# EAGLE design Beacon (EAGLE 6.1)
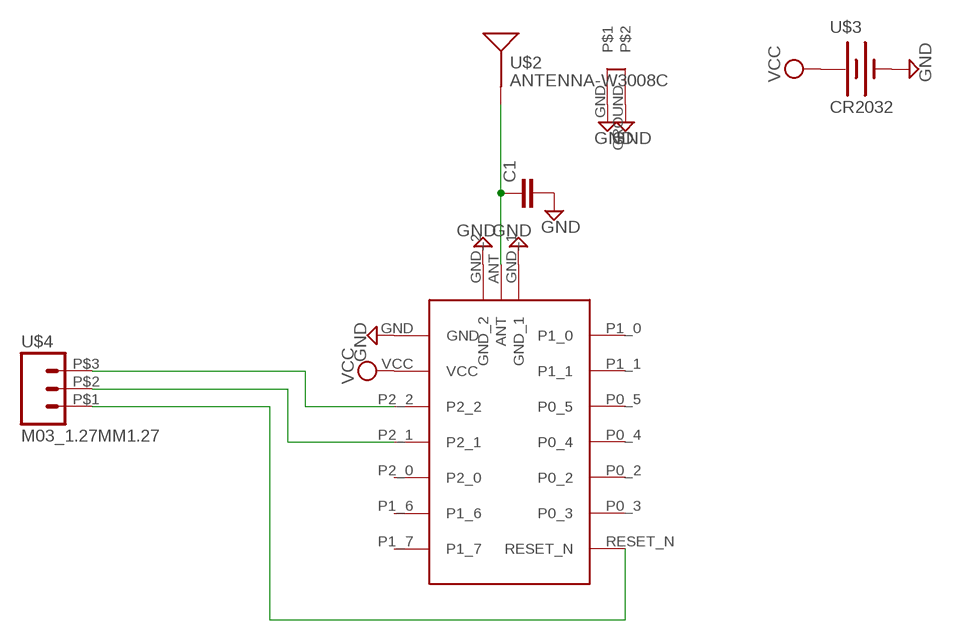
[diagram p0: schematic, sheet 1]

## Parts
C1  CAP0402-CAP  [0402-CAP]
U$1  BLE4  [BLE4]
U$2  ANTENNA-W3008C  [ANTENNA-W3008C]
U$3  CR2032  [BATTCON_2032]
U$4  M03_1.27MM1.27  [1X3_1.27MM]

## Nets
GND: C1.2 U$1.GND U$1.GND_1 U$1.GND_2 U$2.GND U$2.GROUND U$3.PWR@2(-)
N$1: C1.1 U$1.ANT U$2.FEED(SIGNAL)
N$2: U$1.P2_2 U$4.P$3
N$3: U$1.P2_1 U$4.P$2
N$4: U$1.RESET_N U$4.P$1
VCC: U$1.VCC U$3.PWR@1(+)
Unconnected: U$1.P0_2 U$1.P0_3 U$1.P0_4 U$1.P0_5 U$1.P1_0 U$1.P1_1 U$1.P1_6 U$1.P1_7 U$1.P2_0

## Library data of the parts
C1 = SparkFun-Capacitors:CAP: Capacitor Standard 0603 ceramic capacitor, and 0.1" leaded capacitor.
U$1 = foxkn:BLE4
U$2 = SparkFun-RF:ANTENNA-W3008C
U$3 = SparkFun-Electromechanical:CR2032
U$4 = SparkFun-Connectors:M03_1.27MM

## Board
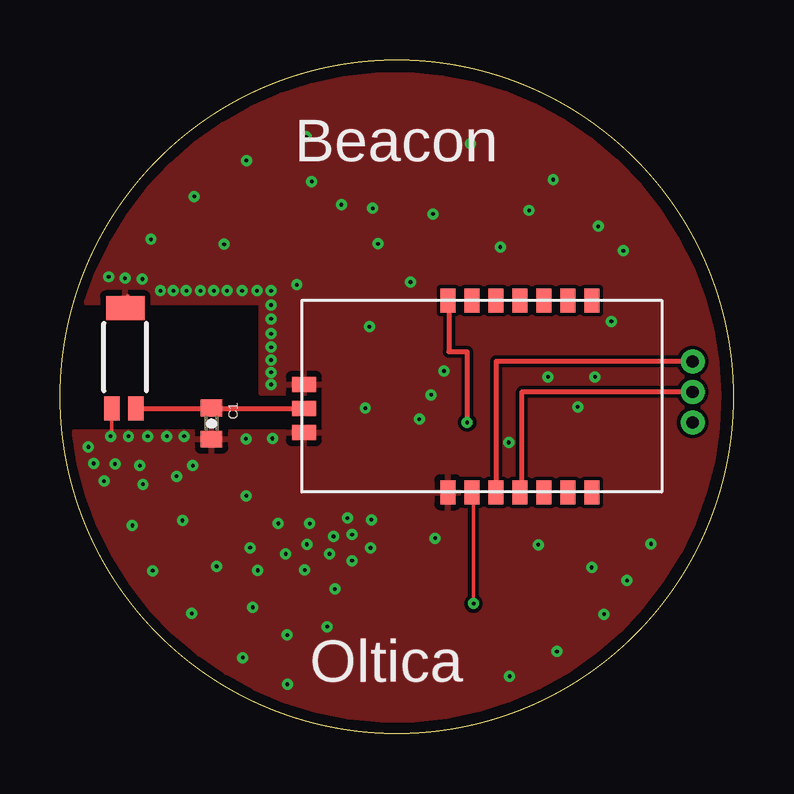
[diagram p1: board, top side]
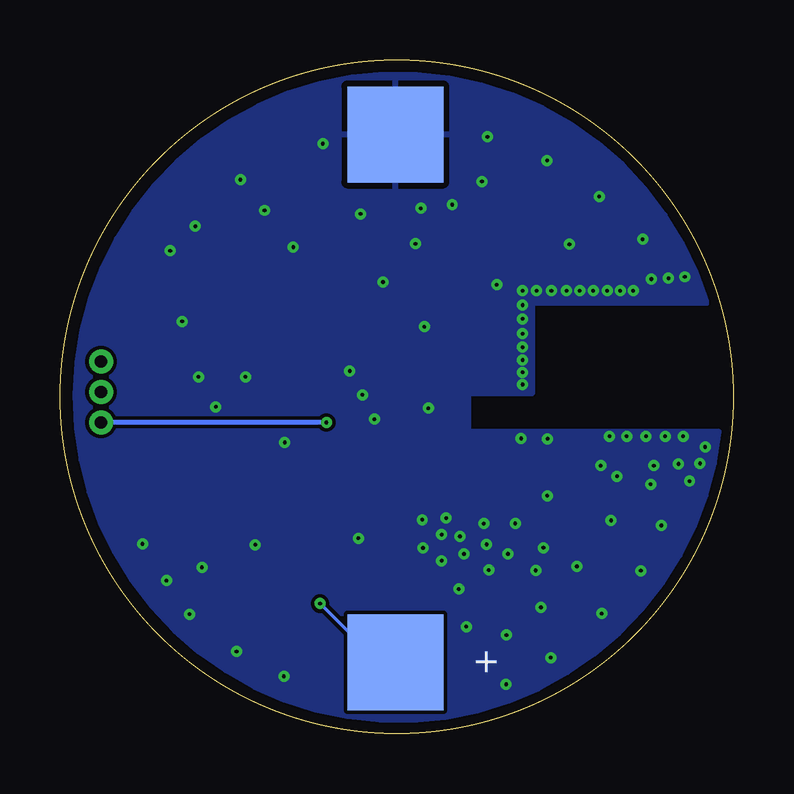
[diagram p2: board, bottom side, seen from below]

Size 28.09 x 28.09 mm. Coordinates in mm from the lower left corner, seen from the top.
Outline: circle at 14.04,14.04 radius 14.04
Copper layers (1*16): Top 0.035mm / dielectric 1.5mm / Bottom 0.035mm
Design rules: minimum track width 6mil, minimum drill 6mil, track to track 6mil, track to pad 6mil, pad to pad 6mil, via to via 6mil, smd to smd 6mil, copper to edge 8mil, drill to drill 6mil, minimum pad ring 6mil, minimum via ring 6mil, stop-mask expansion 4mil, vias tented up to drill 0mil, thermal gap 10mil

### Footprints (pad centres in the part's own frame; a part is rotated, then mirrored left to right if it is on the bottom)
0402-CAP = smd 0.7 x 0.9: 1 -0.65,0; 2 0.65,0
BLE4 = smd 1 x 0.635: ANT 8.54,0.5; GND_1 8.54,-0.5; GND_2 8.54,1.5 | smd 0.635 x 1: GND 2.54,4; P0_2 0.54,-4; P0_3 1.54,-4; P0_4 -0.46,-4; P0_5 -1.46,-4; P1_0 -3.46,-4; P1_1 -2.46,-4; P1_6 -2.46,4; P1_7 -3.46,4; P2_0 -1.46,4; P2_1 -0.46,4; P2_2 0.54,4; RESET_N 2.54,-4; VCC 1.54,4
ANTENNA-W3008C = smd 0.65 x 1: FEED -0.45,2.52; GROUND 0.55,2.52 | smd 1.6 x 1: GND 0,-1.651
BATTCON_2032 = smd 4 x 4: PWR@1 -11.46,0; PWR@2 10.54,0
1X3_1.27MM = drill 0.508 pad 1: P$1 -1.27,0; P$2 0,0; P$3 1.27,0

### Placement (x,y rotation side)
C1  6.32,12.93 270 top
U$1  18.71,14.06 180 top
U$2  2.72,16.08 180 top
U$3  14.1,14.43 90 bottom
U$4  26.38,14.24 90 top

### Tracks (layer width: path | path; a pad name or v marks a point on that pad's centre or on a via)
GND  (via drill 0.15)
  Top 0.152: U$2.GROUND 2.16,13.52 2.16,12.91 2.16,12.51 v2.1,12.39 | 2.82,18.26 2.77,18.2 2.77,17.79 U$2.GND
  other vias: 3.01,8.68 3.87,6.79 5.5,5 7.62,3.16 9.48,2.05 9.47,4.11 1.84,10.52 1.4,11.26 8.04,5.26 6.53,6.97 5.11,8.89 2.3,11.24 3.46,10.4 3.33,11.17 1.19,11.95 11.46,6.03 11.14,4.46 8.25,6.81 9.41,7.49 9.1,8.76 7.93,7.75 4.86,10.73 5.54,11.17 2.85,12.39 3.65,12.39 10.21,6.82 10.3,7.89 11.99,8.98 11.41,8.22 11.24,7.49 10.41,8.75 7.77,9.92 4.45,12.39 5.18,12.39 18.75,2.39 12.98,8.91 12.95,7.74 12.18,7.21 12.18,8.3 2.03,19.04 2.71,18.99 3.43,18.95 7.75,12.29 8.86,12.31 4.19,18.46 20.72,3.43 3.79,20.61 15.64,8.15 8.8,14.55 8.8,15.06 8.8,15.57 8.8,16.11 8.8,16.67 6.96,18.46 6.41,18.46 5.85,18.46 5.27,18.46 4.73,18.46 6.84,20.4 12.73,13.57 8.8,17.29 8.8,17.87 8.8,18.46 8.21,18.46 7.6,18.46 22.68,4.98 5.6,22.39 9.87,18.72 15.48,14.13 14.98,13.11 19.94,7.87 7.78,23.9 12.9,16.96 16.01,15.12 24.64,7.91 13.04,21.9 13.26,20.43 10.49,23.02 11.73,22.05 14.61,18.83 10.26,24.88 15.55,21.67 22.17,6.93 19.56,21.82 18.36,20.28 17.12,24.59 20.56,23.09 22.99,17.19 23.49,20.13 22.44,21.15 23.64,6.38 21.59,13.62 20.35,14.87 22.31,14.87 18.71,12.14
  pour Top: 1.1,17.94 arc-337 0.59,12.59 11.04,12.59 11.04,14.18 8.38,14.18 8.38,17.94
  pour Bottom: 1.1,17.94 arc-337 0.59,12.59 11.04,12.59 11.04,14.19 8.38,14.19 8.38,17.94
N$1
  Top 0.152: C1.1 6.43,13.52 6.43,13.56
  Top 0.203: U$2.FEED 6.43,13.56 U$1.ANT
N$2
  Top 0.203: U$1.P2_2 18.19,10.06 18.19,15.53 26.38,15.53 U$4.P$3
N$3
  Top 0.203: U$1.P2_1 19.27,10.06 19.27,14.26 26.38,14.26 U$4.P$2
N$4  (via drill 0.15)
  Top 0.203: U$1.RESET_N 16.21,18.06 16.21,15.93 16.98,15.93 v16.98,12.97
  Bottom 0.203: v16.98,12.97 U$4.P$1
VCC  (via drill 0.15)
  Top 0.152: v17.24,5.42 17.24,9.9 U$1.VCC
  Top 0.203: U$1.VCC 17.24,10.06
  Bottom 0.152: 14.2,2.99 U$3.PWR@1 14.2,2.99 | v17.24,5.42 14.8,2.99 14.2,2.99

### Text on the board
tPlace: Beacon | Oltica